# EAGLE design 0135-dcdc-neg (EAGLE 9.6.2)
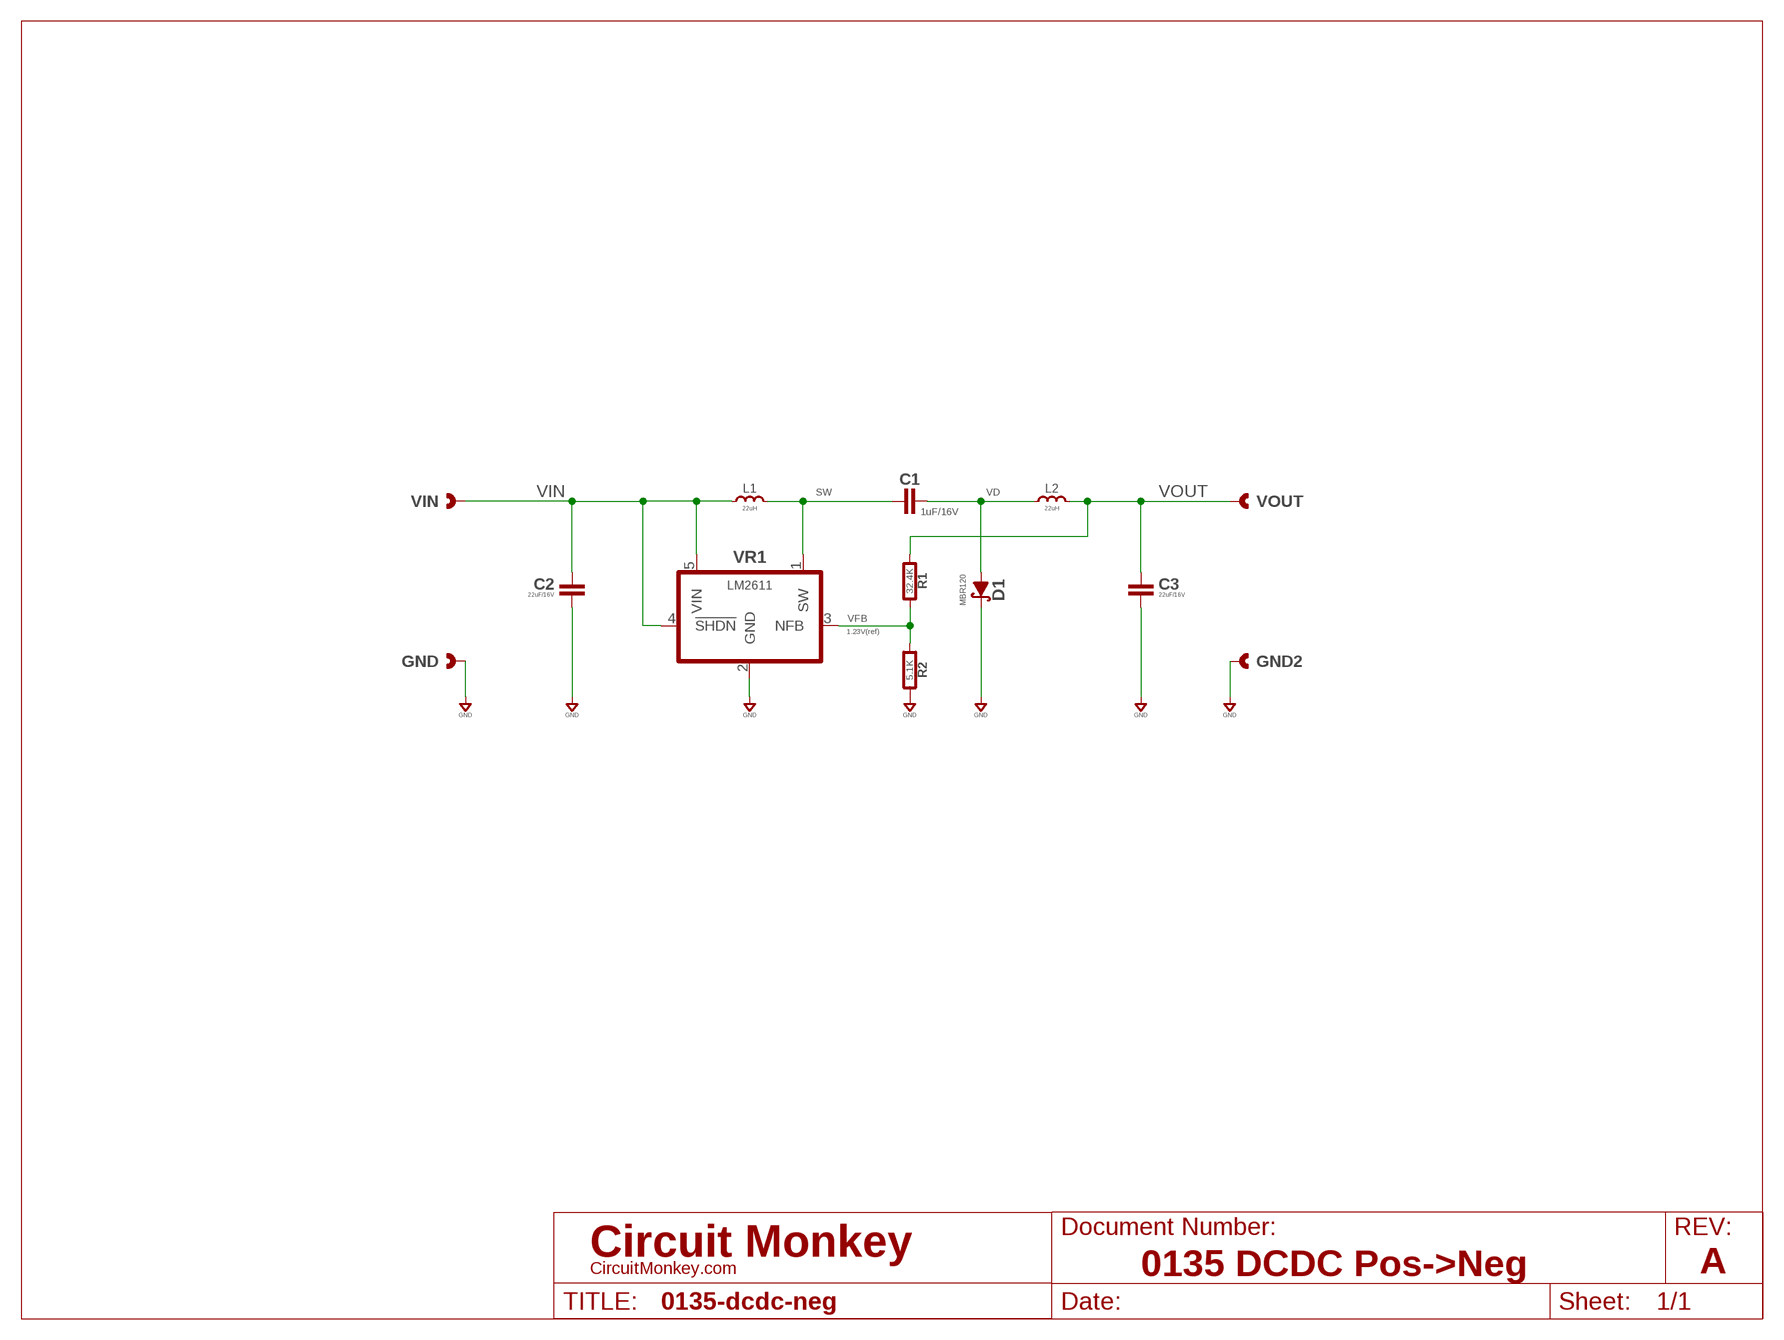
[diagram p0: schematic, sheet 1]
SHEET1 (LETTER_L-CIRCUITMONKEY): DOCUMENT_NUMBER: 0135 DCDC Pos->Neg; REV: A

## Parts
C1  1uF/16V  CAPACITOR0603  [0603-CAP]
C2  22uF/16V  CAPACITOR1210  [1210-CAP]
C3  22uF/16V  CAPACITOR1210  [1210-CAP]
D1  MBR120  SCHOTTKYMBR120  [SOD-123]
GND  CAST-01X12.00MM  [CAST01-2.00MM]
GND2  CAST-01X12.00MM  [CAST01-2.00MM]
L1  22uH  INDUCTORSMD-4.5X3.3MM  [IND-MU8400]
L2  22uH  INDUCTORSMD-4.5X3.3MM  [IND-MU8400]
R1  32.4K  RESISTOR0603  [0603-RES]
R2  5.1K  RESISTOR0603  [0603-RES]
VIN  CAST-01X12.00MM  [CAST01-2.00MM]
VOUT  CAST-01X12.00MM  [CAST01-2.00MM]
VR1  LM2611  CUK-5P-SOT-23-5  [SOT-23-5]

## Nets
GND: C2.2 C3.2 D1.K GND2.1 GND2.P$1 GND2.P$2 GND.1 GND.P$1 GND.P$2 R2.2 VR1.2(GND)
SW: C1.1 L1.1 VR1.1(SW)
VD: C1.2 D1.A L2.2
VFB: R1.2 R2.1 VR1.3(NFB)
VIN: C2.1 L1.2 VIN.1 VIN.P$1 VIN.P$2 VR1.4(!SHDN) VR1.5(VIN)
VOUT: C3.1 L2.1 R1.1 VOUT.1 VOUT.P$1 VOUT.P$2

## Notes on the sheet
- 1.23V(ref)

## Library data of the parts
C1 = rlc:CAPACITOR: Capacitor; COST01: 0.12; COST10: 0.09; COST100: 0.05
C2 C3 = rlc:CAPACITOR: Capacitor
D1 = diodes:SCHOTTKY: Schottky Diodes; MPN: MBR120ES
GND GND2 VIN VOUT = con-headers:CAST-01X1: Castelated Edge Hole Pad
L1 L2 = rlc:INDUCTOR: Inductor; COST01: 0.55; COST10: 0.50; COST100: 0.35; MFR: MuRata; MPN: 8400 Series
R1 R2 = rlc:RESISTOR: Resistor; COST01: 0.10; COST10: 0.05; COST100: 0.02
VR1 = regulators:CUK-5P: CUK Converter, Pos input to neg output.; COST01: 3.30; COST10: 3.00; COST100: 2.45; MFR: TI; MPN: LM2611

## Board
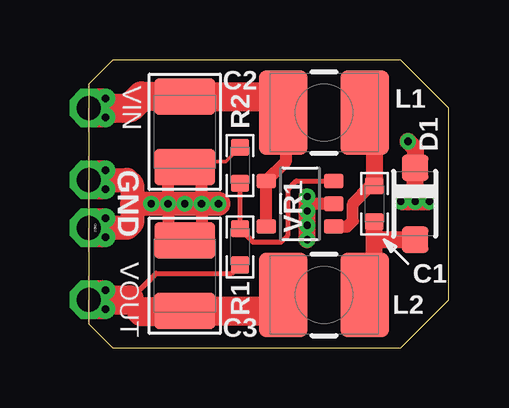
[diagram p1: board, top side]
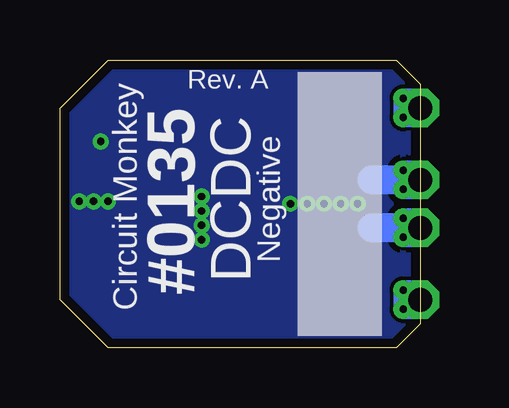
[diagram p2: board, bottom side, seen from below]

Size 15 x 12 mm. Coordinates in mm from the lower left corner, seen from the top.
Outline: 1,0 13,0 15,2 15,10 13,12 1,12 0,11 0,1 1,0
Copper layers (1*16): Top 0.0712mm / dielectric 0.657mm / Bottom 0.0712mm
Design rules "OSH-CircuitMonkey-thin": minimum track width 6mil, minimum drill 12mil, track to track 6mil, track to pad 6mil, pad to pad 6mil, via to via 6mil, smd to smd 6mil, copper to edge 15mil, drill to drill 6mil, minimum pad ring 7mil, minimum via ring 7mil, stop-mask expansion 3mil, vias tented up to drill 14mil, thermal gap 10mil

### Footprints (pad centres in the part's own frame; a part is rotated, then mirrored left to right if it is on the bottom)
0603-CAP = smd 0.711 x 0.762: 1 -0.752,0; 2 0.752,0
1210-CAP = smd 1.5 x 2.54: 1 -1.472,0; 2 1.472,0
SOD-123 = smd 1.1 x 1.1: A 1.5,0; K -1.5,0
CAST01-2.00MM = drill 1 pad 1.6 octagon: 1 0,0 | drill 0.305 pad 0.813: P$1 -0.7,0.4; P$2 -0.7,-0.4
IND-MU8400 = smd 2 x 3.5: 1 -1.7,0; 2 1.7,0
0603-RES = smd 0.711 x 0.762: 1 -0.752,0; 2 0.752,0
SOT-23-5 = smd 0.6 x 0.8: 1 -0.95,-1.4; 2 0,-1.4; 3 0.95,-1.4; 4 0.95,1.4; 5 -0.95,1.4

### Placement (x,y rotation side)
C1  11.9,6 270 top
C2  4,9 270 top
C3  4,3 90 top
D1  13.6,6 270 top
GND  0,7 180 top
GND2  0,5 180 top
L1  9.8,9.8 180 top
L2  9.8,2.2 0 top
R1  6.3,4.2 90 top
R2  6.3,7.6 90 top
VIN  0,10 180 top
VOUT  0,2 180 top
VR1  8.8,6 90 top

### Tracks (layer width: path | path; a pad name or v marks a point on that pad's centre or on a via)
GND  (via drill 0.3)
  Top 0.152: R2.2 5.7,7.75 4.8,7.75 4.58,7.53 4.1,7.53 | 0.3,7 GND.P$2 | 0.3,5 GND2.P$2 | GND.1 0.3,7 | 0.3,7 GND.P$1 | GND2.1 0.3,5 | 0.3,5 GND2.P$1
  Top 0.5: VR1.2 9.1,6 | 4.7,7.13 4.7,7.2 | 4.1,7.53 4.3,7.53 | C2.2 3.93,7.53 3.3,6.9 v3.3,6 3.3,4.97 3.8,4.47 C3.2 4.3,4.47 4.7,4.87 v4.7,6 4.7,6.93 4.51,7.11
  Top 0.508: 4.51,7.11 4.1,7.53 C2.2 4.3,7.53 4.7,7.13
  Top 0.7: v9.1,4.5 9.1,6 v9.1,6.3 | v13,6.1 v13.6,6.1 | v13.6,6.1 v14.2,6.1 | v13.3,8.6 13.6,8.3 D1.K v13.6,6.1
  Top 1: v5.4,6 v4.7,6 v3.3,6 1.8,6 | 1.8,6 1.8,5.2 1.6,5 GND2.1 | GND.1 1.6,7 1.8,6.8 1.8,6
  Bottom 1.2: GND.1 2,7 | GND2.1 2,5
  other vias: 4,6 2.6,6 9.1,5.7 9.1,5.1
  pour Bottom: 0,0 0,12 15,12 15,0
SW
  Top 0.5: VR1.1 10.77,5.05 11,5.29 11,6 11.75,6.75 C1.1 | L1.1 11.9,9.4
  Top 0.7: 11.9,9.4 C1.1
VD
  Top 0.7: L2.2 11.5,3.12 11.9,3.52 11.9,4.5 | 11.9,4.5 C1.2 | D1.A 11.9,4.5
VFB
  Top 0.2: R2.1 R1.2 6.85,4.4 8,4.4 8.3,4.7 8.3,6.6 8.65,6.95 VR1.3
VIN
  Top 0.152: 0.3,10 VIN.P$2 | VIN.1 0.3,10 | 0.3,10 VIN.P$1
  Top 0.5: VR1.5 VR1.4 8.2,7.75 8.2,9.7 L1.2
  Top 1.2: VIN.1 1.7,10 2.2,10.5 3.97,10.5 C2.1 7.73,10.47 8.1,10.1 L1.2
VOUT
  Top 0.152: 0.3,2 VOUT.P$2 | VOUT.1 0.3,2 | 0.3,2 VOUT.P$1
  Top 0.2: 2.2,1.5 1.7,2 2.8,3.1 5.95,3.1 R1.1
  Top 1.2: 2.2,1.5 3.97,1.5 C3.1 8.07,1.53 8.1,1.5 L2.1 | VOUT.1 1.7,2

### Text on the board
bPlace: Rev. A | Negative | DCDC | #0135 | Circuit Monkey